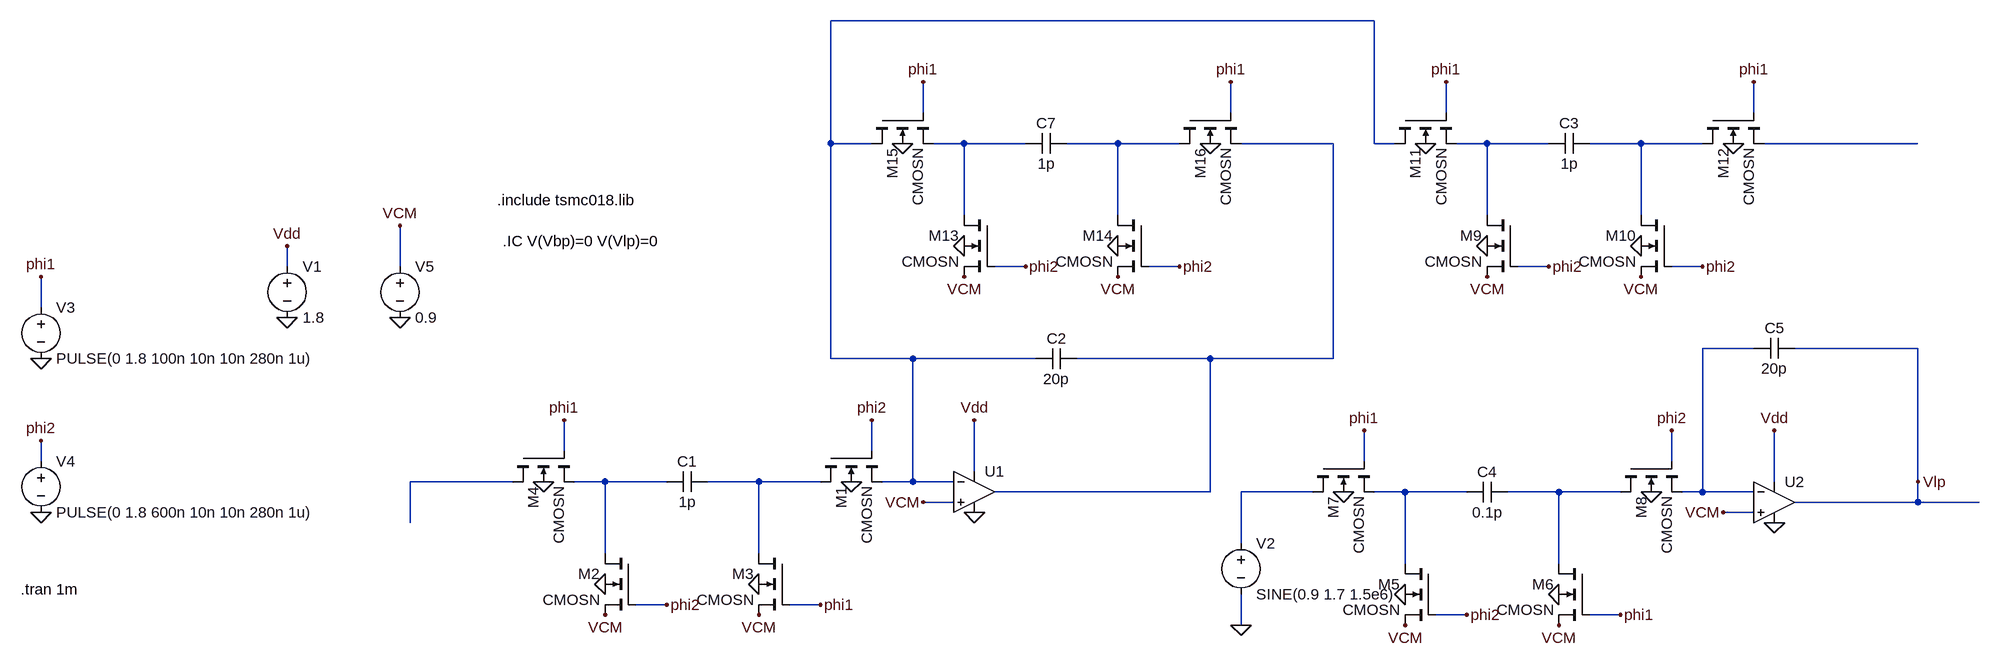
[diagram p0: schematic filtro_integrador.asc]
filtro_integrador.asc, the LTspice schematic file:
Version 4
SHEET 1 3232 680
WIRE 832 -672 -16 -672
WIRE 128 -528 128 -576
WIRE 608 -528 608 -576
WIRE 944 -528 944 -576
WIRE 1424 -528 1424 -576
WIRE -16 -480 -16 -672
WIRE 48 -480 -16 -480
WIRE 192 -480 144 -480
WIRE 288 -480 192 -480
WIRE 432 -480 352 -480
WIRE 528 -480 432 -480
WIRE 768 -480 624 -480
WIRE 832 -480 832 -672
WIRE 864 -480 832 -480
WIRE 1008 -480 960 -480
WIRE 1104 -480 1008 -480
WIRE 1248 -480 1168 -480
WIRE 1344 -480 1248 -480
WIRE 1680 -480 1440 -480
WIRE 192 -368 192 -480
WIRE 432 -368 432 -480
WIRE 1008 -368 1008 -480
WIRE 1248 -368 1248 -480
WIRE -864 -288 -864 -320
WIRE -688 -288 -688 -352
WIRE 288 -288 240 -288
WIRE 528 -288 480 -288
WIRE 1104 -288 1056 -288
WIRE 1344 -288 1296 -288
WIRE 192 -272 192 -288
WIRE 1008 -272 1008 -288
WIRE -1248 -224 -1248 -272
WIRE 1424 -160 1344 -160
WIRE 1680 -160 1488 -160
WIRE -16 -144 -16 -480
WIRE 112 -144 -16 -144
WIRE 304 -144 112 -144
WIRE 576 -144 368 -144
WIRE 768 -144 768 -480
WIRE 768 -144 576 -144
WIRE -432 0 -432 -48
WIRE 48 0 48 -48
WIRE -1248 16 -1248 -16
WIRE 816 16 816 -32
WIRE 1296 16 1296 -32
WIRE 208 32 208 -48
WIRE -512 48 -672 48
WIRE -368 48 -416 48
WIRE -272 48 -368 48
WIRE -128 48 -208 48
WIRE -32 48 -128 48
WIRE 112 48 112 -144
WIRE 112 48 64 48
WIRE 176 48 112 48
WIRE 1456 48 1456 -32
WIRE 1680 48 1680 -160
WIRE 576 64 576 -144
WIRE 576 64 240 64
WIRE 736 64 624 64
WIRE 880 64 832 64
WIRE 976 64 880 64
WIRE 1120 64 1040 64
WIRE 1216 64 1120 64
WIRE 1344 64 1344 -160
WIRE 1344 64 1312 64
WIRE 1424 64 1344 64
WIRE 176 80 128 80
WIRE 1680 80 1680 48
WIRE 1680 80 1488 80
WIRE 1776 80 1680 80
WIRE 1424 96 1376 96
WIRE -672 112 -672 48
WIRE 624 144 624 64
WIRE -368 160 -368 48
WIRE -128 160 -128 48
WIRE 880 176 880 64
WIRE 1120 176 1120 64
WIRE -272 240 -320 240
WIRE -32 240 -80 240
WIRE -368 256 -368 240
WIRE 976 256 928 256
WIRE 1216 256 1168 256
WIRE 624 272 624 224
WIRE 880 272 880 256
FLAG 208 96 0
FLAG -864 -208 0
FLAG -864 -320 Vdd
FLAG 208 -48 Vdd
FLAG -1248 96 0
FLAG -1248 -144 0
FLAG -1248 -272 phi1
FLAG -432 -48 phi1
FLAG -1248 -16 phi2
FLAG -464 48 0
FLAG -368 208 0
FLAG -128 208 0
FLAG 16 48 0
FLAG -272 240 phi2
FLAG 128 -576 phi1
FLAG 96 -480 0
FLAG 192 -320 0
FLAG 432 -320 0
FLAG 576 -480 0
FLAG 608 -576 phi1
FLAG 288 -288 phi2
FLAG 528 -288 phi2
FLAG 624 272 0
FLAG -688 -208 0
FLAG -688 -352 VCM
FLAG 128 80 VCM
FLAG -368 256 VCM
FLAG -128 256 VCM
FLAG 192 -272 VCM
FLAG 432 -272 VCM
FLAG -32 240 phi1
FLAG 48 -48 phi2
FLAG 1456 112 0
FLAG 1456 -32 Vdd
FLAG 816 -32 phi1
FLAG 784 64 0
FLAG 880 224 0
FLAG 1120 224 0
FLAG 1264 64 0
FLAG 976 256 phi2
FLAG 944 -576 phi1
FLAG 912 -480 0
FLAG 1008 -320 0
FLAG 1248 -320 0
FLAG 1392 -480 0
FLAG 1424 -576 phi1
FLAG 1104 -288 phi2
FLAG 1344 -288 phi2
FLAG 1376 96 VCM
FLAG 880 272 VCM
FLAG 1120 272 VCM
FLAG 1008 -272 VCM
FLAG 1248 -272 VCM
FLAG 1216 256 phi1
FLAG 1296 -32 phi2
FLAG 1680 48 Vlp
SYMBOL OpAmps\\UniversalOpAmp2 208 64 R0
SYMATTR InstName U1
SYMATTR Value2 Avol=1Meg GBW=10Meg Slew=100Meg
SYMATTR SpiceLine2 En=0 Enk=0 In=0 Ink=0 Rin=5000Meg
SYMBOL cap -208 32 R90
WINDOW 0 0 32 VBottom 2
WINDOW 3 32 32 VTop 2
SYMATTR InstName C1
SYMATTR Value 1p
SYMBOL voltage -864 -304 R0
WINDOW 123 0 0 Left 0
WINDOW 39 0 0 Left 0
SYMATTR InstName V1
SYMATTR Value 1.8
SYMBOL voltage -1248 -240 R0
WINDOW 123 0 0 Left 0
WINDOW 39 0 0 Left 0
SYMATTR InstName V3
SYMATTR Value PULSE(0 1.8 100n 10n 10n 280n 1u)
SYMBOL cap 368 -160 R90
WINDOW 0 0 32 VBottom 2
WINDOW 3 32 32 VTop 2
SYMATTR InstName C2
SYMATTR Value 20p
SYMBOL voltage -1248 0 R0
WINDOW 123 0 0 Left 0
WINDOW 39 0 0 Left 0
SYMATTR InstName V4
SYMATTR Value PULSE(0 1.8 600n 10n 10n 280n 1u)
SYMBOL cmosn -320 160 M0
SYMATTR InstName M2
SYMATTR Value2 l=500n w=2u
SYMBOL cmosn -80 160 M0
SYMATTR InstName M3
SYMATTR Value2 l=500n w=2u
SYMBOL cmosn -512 0 M90
SYMATTR InstName M4
SYMATTR Value2 l=500n w=2u
SYMBOL cmosn -32 0 M90
SYMATTR InstName M1
SYMATTR Value2 l=500n w=2u
SYMBOL cap 352 -496 R90
WINDOW 0 0 32 VBottom 2
WINDOW 3 32 32 VTop 2
SYMATTR InstName C7
SYMATTR Value 1p
SYMBOL cmosn 240 -368 M0
SYMATTR InstName M13
SYMATTR Value2 l=500n w=2u
SYMBOL cmosn 480 -368 M0
SYMATTR InstName M14
SYMATTR Value2 l=500n w=2u
SYMBOL cmosn 48 -528 M90
SYMATTR InstName M15
SYMATTR Value2 l=500n w=2u
SYMBOL cmosn 528 -528 M90
SYMATTR InstName M16
SYMATTR Value2 l=500n w=2u
SYMBOL voltage 624 128 R0
WINDOW 123 0 0 Left 0
WINDOW 39 0 0 Left 0
SYMATTR InstName V2
SYMATTR Value SINE(0.9 1.7 1.5e6)
SYMBOL voltage -688 -304 R0
WINDOW 123 0 0 Left 0
WINDOW 39 0 0 Left 0
SYMATTR InstName V5
SYMATTR Value 0.9
SYMBOL OpAmps\\UniversalOpAmp2 1456 80 R0
SYMATTR InstName U2
SYMATTR Value2 Avol=1Meg GBW=10Meg Slew=100Meg
SYMATTR SpiceLine2 En=0 Enk=0 In=0 Ink=0 Rin=5000Meg
SYMBOL cap 1040 48 R90
WINDOW 0 0 32 VBottom 2
WINDOW 3 32 32 VTop 2
SYMATTR InstName C4
SYMATTR Value 0.1p
SYMBOL cmosn 928 176 M0
SYMATTR InstName M5
SYMATTR Value2 l=500n w=2u
SYMBOL cmosn 1168 176 M0
SYMATTR InstName M6
SYMATTR Value2 l=500n w=2u
SYMBOL cmosn 736 16 M90
SYMATTR InstName M7
SYMATTR Value2 l=500n w=2u
SYMBOL cmosn 1216 16 M90
SYMATTR InstName M8
SYMATTR Value2 l=500n w=2u
SYMBOL cap 1168 -496 R90
WINDOW 0 0 32 VBottom 2
WINDOW 3 32 32 VTop 2
SYMATTR InstName C3
SYMATTR Value 1p
SYMBOL cmosn 1056 -368 M0
SYMATTR InstName M9
SYMATTR Value2 l=500n w=2u
SYMBOL cmosn 1296 -368 M0
SYMATTR InstName M10
SYMATTR Value2 l=500n w=2u
SYMBOL cmosn 864 -528 M90
SYMATTR InstName M11
SYMATTR Value2 l=500n w=2u
SYMBOL cmosn 1344 -528 M90
SYMATTR InstName M12
SYMATTR Value2 l=500n w=2u
SYMBOL cap 1488 -176 R90
WINDOW 0 0 32 VBottom 2
WINDOW 3 32 32 VTop 2
SYMATTR InstName C5
SYMATTR Value 20p
TEXT -536 -392 Left 2 !.include tsmc018.lib
TEXT -1280 216 Left 2 !.tran 1m
TEXT -528 -328 Left 2 !.IC V(Vbp)=0 V(Vlp)=0

The netlist it stands for:
* filtro_integrador.asc
XU1 VCM N001 Vdd 0 N004 level2 Avol=1Meg GBW=10Meg Slew=100Meg Ilimit=25m Rail=0 Vos=0 En=0 Enk=0 In=0 Ink=0 Rin=5000Meg  ; pins In+ In- V+ V- OUT
C1 N011 N010 1p
V1 Vdd 0 1.8
V3 phi1 0 PULSE(0 1.8 100n 10n 10n 280n 1u)
C2 N004 N001 20p
V4 phi2 0 PULSE(0 1.8 600n 10n 10n 280n 1u)
M2 N010 phi2 VCM 0 CMOSN l=500n w=2u
M3 N011 phi1 VCM 0 CMOSN l=500n w=2u
M4 N009 phi1 N010 0 CMOSN l=500n w=2u
M1 N011 phi2 N001 0 CMOSN l=500n w=2u
C7 N003 N002 1p
M13 N002 phi2 VCM 0 CMOSN l=500n w=2u
M14 N003 phi2 VCM 0 CMOSN l=500n w=2u
M15 N001 phi1 N002 0 CMOSN l=500n w=2u
M16 N003 phi1 N004 0 CMOSN l=500n w=2u
V2 N012 0 SINE(0.9 1.7 1.5e6)
V5 VCM 0 0.9
XU2 VCM N008 Vdd 0 Vlp level2 Avol=1Meg GBW=10Meg Slew=100Meg Ilimit=25m Rail=0 Vos=0 En=0 Enk=0 In=0 Ink=0 Rin=5000Meg  ; pins In+ In- V+ V- OUT
C4 N014 N013 0.1p
M5 N013 phi2 VCM 0 CMOSN l=500n w=2u
M6 N014 phi1 VCM 0 CMOSN l=500n w=2u
M7 N012 phi1 N013 0 CMOSN l=500n w=2u
M8 N014 phi2 N008 0 CMOSN l=500n w=2u
C3 N006 N005 1p
M9 N005 phi2 VCM 0 CMOSN l=500n w=2u
M10 N006 phi2 VCM 0 CMOSN l=500n w=2u
M11 N001 phi1 N005 0 CMOSN l=500n w=2u
M12 N006 phi1 N007 0 CMOSN l=500n w=2u
C5 Vlp N008 20p
.model NMOS NMOS
.model PMOS PMOS
.lib standard.mos
.include tsmc018.lib
.tran 1m
.IC V(Vbp)=0 V(Vlp)=0
.lib UniversalOpAmp2.lib
.backanno
.end